# Altium schematic sheet schematic.SchDoc
size A4
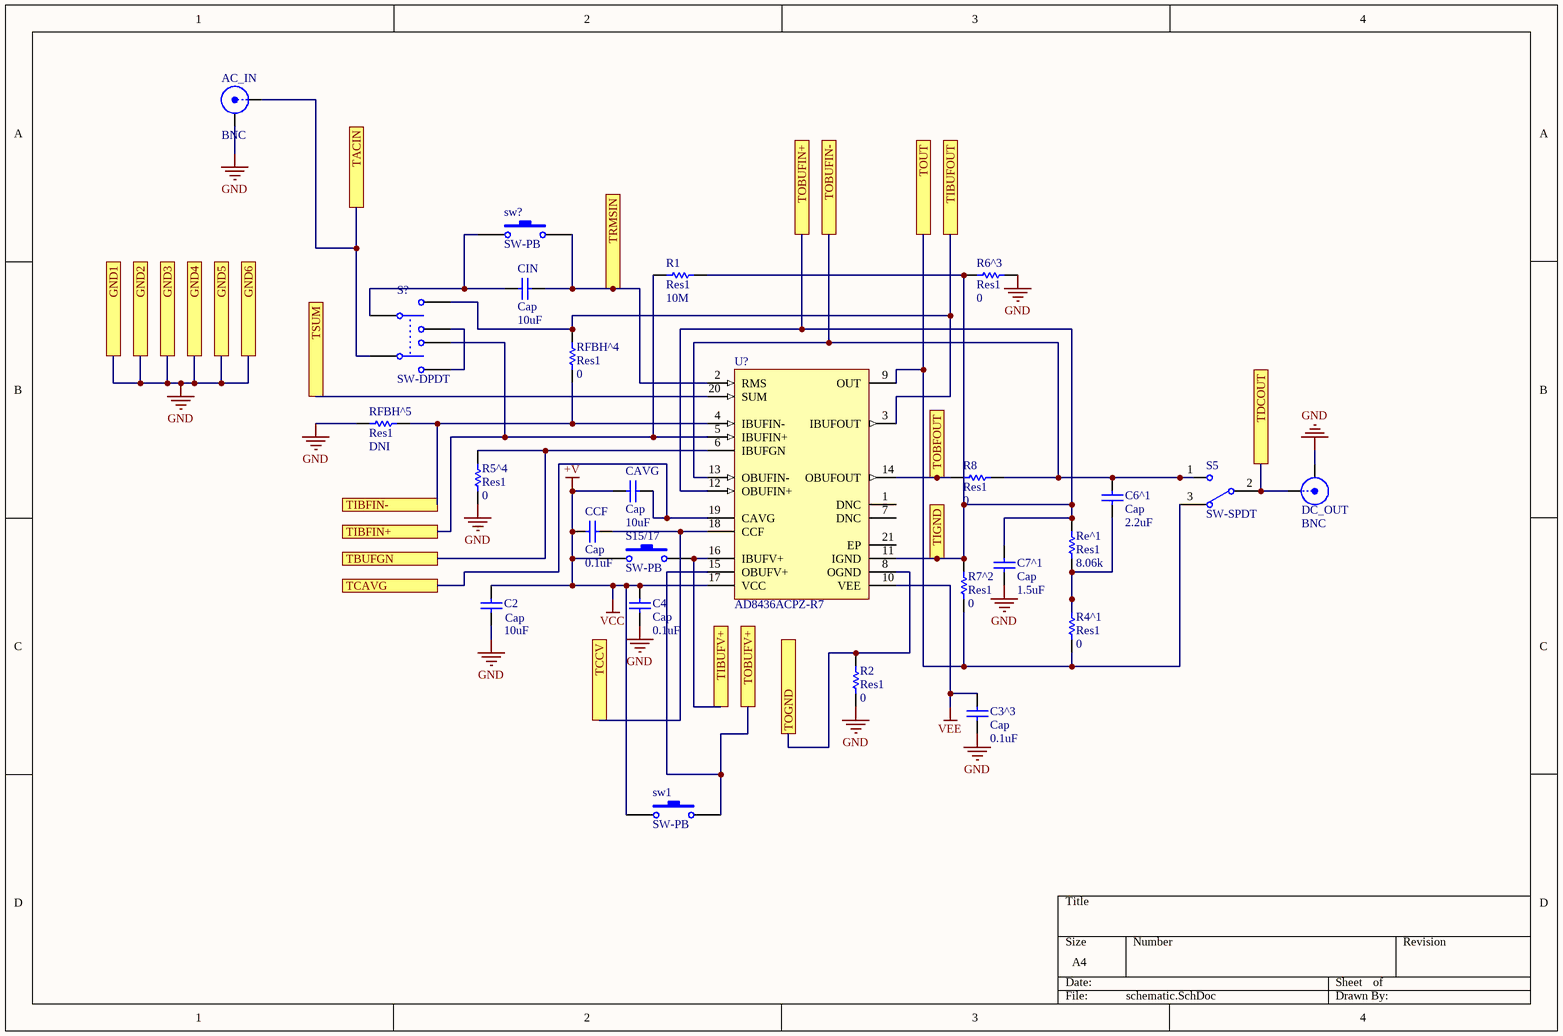
[diagram p0: schematic.SchDoc]

## Parts
AC_IN  BNC  [BNC_RA CON]
C2  Cap  value 10uF  [RAD-0.3]
C3^3  Cap  value 0.1uF  [RAD-0.3]
C4  Cap  value 0.1uF  [RAD-0.3]
C6^1  Cap  value 2.2uF  [RAD-0.3]
C7^1  Cap  value 1.5uF  [RAD-0.3]
CAVG  Cap  value 10uF  [RAD-0.3]
CCF  Cap  value 0.1uF  [RAD-0.3]
CIN  Cap  value 10uF  [RAD-0.3]
DC_OUT  BNC  [BNC_RA CON]
R1  Res1  value 10M  [AXIAL-0.3]
R2  Res1  value 0  [AXIAL-0.3]
R4^1  Res1  value 0  [AXIAL-0.3]
R5^4  Res1  value 0  [AXIAL-0.3]
R6^3  Res1  value 0  [AXIAL-0.3]
R7^2  Res1  value 0  [AXIAL-0.3]
R8  Res1  value 0  [AXIAL-0.3]
Re^1  Res1  value 8.06k  [AXIAL-0.3]
RFBH^4  Res1  value 0  [AXIAL-0.3]
RFBH^5  Res1  value DNI  [AXIAL-0.3]
S5  SW-SPDT  [TL36WW15050]
S15/17  SW-PB  [SPST-2]
S?  SW-DPDT  [DPDT-6]
sw1  SW-PB  [SPST-2]
sw?  SW-PB  [SPST-2]
U?  AD8436ACPZ-R7  [ADI-CP-20-10_M]

## Ports
GND1, GND2, GND3, GND4, GND5, GND6, TACIN, TBUFGN, TCAVG, TCCV, TDCOUT, TIBFIN+, TIBFIN-, TIBUFOUT, TIBUFV+, TIGND, TOBFOUT, TOBUFIN+, TOBUFIN-, TOBUFV+, TOGND, TOUT, TRMSIN, TSUM

## Nets
+V: C2.1 C4.2 CAVG.1 CCF.1 S15/17.1 sw1.1 U?.17(VCC)  [also labelled VCC]
GND: AC_IN.2(Y) C2.2 C3^3.1 C4.1 C7^1.1 DC_OUT.2(Y) R2.1 R5^4.1 R6^3.2 RFBH^5.2 ; port GND1, port GND2, port GND3, port GND4, port GND5, port GND6
VEE: C3^3.2 U?.10(VEE)
TACIN: AC_IN.1(X) S?.4 ; port TACIN
TBUFGN: R5^4.2 U?.6(IBUFGN) ; port TBUFGN
TCAVG: CAVG.2 U?.19(CAVG) ; port TCAVG
TCCV: CCF.2 U?.18(CCF) ; port TCCV
TDCOUT: DC_OUT.1(X) S5.2 ; port TDCOUT
TIBFIN+: R1.1 S?.5 U?.5(IBUFIN+) ; port TIBFIN+
TIBFIN-: RFBH^4.1 RFBH^5.1 U?.4(IBUFIN-) ; port TIBFIN-
TIBUFOUT: RFBH^4.2 S?.2 U?.3(IBUFOUT) ; port TIBUFOUT
TIBUFV+: S15/17.2 U?.16(IBUFV+) ; port TIBUFV+
TIGND: C7^1.2 R1.2 R6^3.1 R7^2.2 Re^1.2 U?.11(IGND) U?.12(OBUFIN+) ; port TIGND, port TOBUFIN+
TOBFOUT: R8.1 U?.14(OBUFOUT) ; port TOBFOUT
TOBUFIN-: C6^1.2 R8.2 S5.1 U?.13(OBUFIN-) ; port TOBUFIN-
TOBUFV+: sw1.2 U?.15(OBUFV+) ; port TOBUFV+
TOGND: R2.2 U?.8(OGND) ; port TOGND
TOUT: R4^1.1 R7^2.1 S5.3 U?.9(OUT) ; port TOUT
TRMSIN: CIN.2 sw?.2 U?.2(RMS) ; port TRMSIN
TSUM: U?.20(SUM) ; port TSUM
NetC6^1_1: C6^1.1 R4^1.2 Re^1.1
NetCIN_1: CIN.1 S?.1 sw?.1
NetS?_3: S?.3 S?.6

Not connected (* = marked no-connect by the designer): U? 1(DNC) 7(DNC) 21(EP)

## Library data of the parts
AC_IN DC_OUT = BNC: BNC Elbow Connector; LatestRevisionDate: 17-Jul-2002; LatestRevisionNote: Re-released for DXP Platform.; Publisher: Altium Limited
C2 C3^3 C4 C6^1 C7^1 CAVG CCF CIN = Cap: Capacitor; Published: 8-Jun-2000; LatestRevisionDate: 17-Jul-2002; LatestRevisionNote: Re-released for DXP Platform.; PackageReference: RAD-0.3; Publisher: Altium Limited; PackageDescription: Radial Cap, Thru-Hole; 2 Leads; 0.3 in Pin Spacing
R1 R2 R4^1 R5^4 R6^3 R7^2 R8 Re^1 RFBH^4 RFBH^5 = Res1: Resistor; Published: 8-Jun-2000; LatestRevisionDate: 17-Jul-2002; LatestRevisionNote: Re-released for DXP Platform.; PackageReference: AXIAL-0.3; Publisher: Altium Limited; PackageDescription: Axial Device, Thru-Hole; 2 Leads; 0.3 in Pin Spacing
S5 = SW-SPDT: SPDT Subminiature Toggle Switch, Right Angle Mounting, Vertical Actuation; Published: 24-Mar-1999; LatestRevisionDate: 17-Dec-2003; LatestRevisionNote: Schematic revised, PCB Footprint replaced.; DatasheetVersion: 05-Dec-2000; PackageReference: TL36WW15050; Publisher: Altium Limited; PackageDescription: Switch; 4 Leads; ComponentLink1Description: Manufacturer Link; ComponentLink1URL: http://www.apem.com
S15/17 sw1 sw? = SW-PB: Switch; Published: 24-Mar-1999; LatestRevisionDate: 17-Jul-2002; LatestRevisionNote: Re-released for DXP Platform.; PackageReference: SPST-2; Publisher: Altium Limited; PackageDescription: Switch; 2 Leads
S? = SW-DPDT: Double-Pole, Double-Throw Switch; Published: 24-Mar-1999; LatestRevisionDate: 17-Jul-2002; LatestRevisionNote: Re-released for DXP Platform.; PackageReference: DPDT-6; Publisher: Altium Limited; PackageDescription: Switch; 6 Leads
U? = CMP-0527-00003-3: Low Cost, Low Power, True RMS-to-DC Converter, 4.8 to 36 V Single Supply, -40 to 125 degC, 20-Pin QFN (CP-20-10); Manufacturer: Analog Devices; -3dB Bandwidth: 950 KHz; Max Vin (V-rms): 3 V rms; V Span (min): 4.8 V; Supply Current: 300 uA; V Span (max): 36 V; Error (%@ CF: 3)=0.5; PackageVersion: Rev. B; DatasheetVersion: Rev. B; PackageDescription: 20-Pin Frame Chip Scale Package, Body 4 x 4 mm, Pitch 0.5 mm; ComponentLink3URL: http://www.analog.com/static/imported-files/packages/PKG_PDF/LFCSP(CP)/CP_20_10.pdf; ComponentLink2Description: Datasheet; ComponentLink1Description: Manufacturer URL; Operating Temperature Range: -40 to 125 degC; ComponentLink1URL: http://www.analog.com/; ComponentLink3Description: Package Specification; RoHS: TRUE; PartNumber: AD8436ACPZ-R7; PackageReference: CP-20-10; ComponentLink2URL: http://www.analog.com/static/imported-files/data_sheets/AD8436.pdf; Mounting Technology: Surface Mount